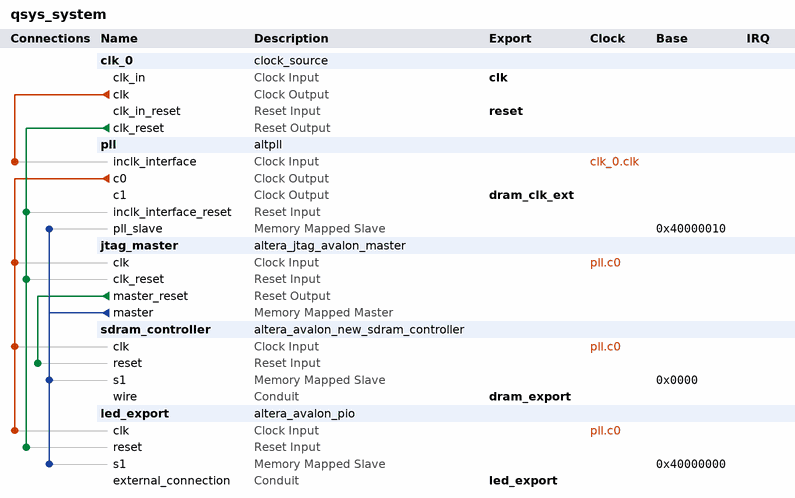
[diagram p0: system contents]
# Platform Designer (Qsys) system qsys_system, MAX 10 10M50DAF484C7G
# Parameters at their usual value, and those the tool derives, are not listed.
package require -exact qsys 18.1
create_system qsys_system
set_project_property DEVICE_FAMILY {MAX 10}
set_project_property DEVICE 10M50DAF484C7G

add_instance clk_0 clock_source 18.1
set_instance_parameter_value clk_0 clockFrequency 50000000

add_instance pll altpll 18.1
set_instance_parameter_value pll CLK0_DIVIDE_BY 1
set_instance_parameter_value pll CLK0_MULTIPLY_BY 2
set_instance_parameter_value pll CLK1_DIVIDE_BY 1
set_instance_parameter_value pll CLK1_DUTY_CYCLE 50
set_instance_parameter_value pll CLK1_MULTIPLY_BY 2
set_instance_parameter_value pll CLK1_PHASE_SHIFT -3000
set_instance_parameter_value pll INCLK0_INPUT_FREQUENCY 20000
set_instance_parameter_value pll PORT_ARESET PORT_UNUSED
set_instance_parameter_value pll PORT_LOCKED PORT_UNUSED
set_instance_parameter_value pll PORT_clk1 PORT_USED
set_instance_parameter_value pll PORT_clk2 PORT_UNUSED
set_instance_parameter_value pll PORT_clk3 PORT_UNUSED

add_instance jtag_master altera_jtag_avalon_master 18.1

add_instance sdram_controller altera_avalon_new_sdram_controller 18.1
set_instance_parameter_value sdram_controller TAC 6.0
set_instance_parameter_value sdram_controller TRCD 15.0
set_instance_parameter_value sdram_controller TRFC 55.0
set_instance_parameter_value sdram_controller TRP 15.0
set_instance_parameter_value sdram_controller TWR 15.0
set_instance_parameter_value sdram_controller casLatency 2
set_instance_parameter_value sdram_controller columnWidth 10
set_instance_parameter_value sdram_controller dataWidth 16
set_instance_parameter_value sdram_controller generateSimulationModel false
set_instance_parameter_value sdram_controller initRefreshCommands 8
set_instance_parameter_value sdram_controller model single_Micron_MT48LC4M32B2_7_chip
set_instance_parameter_value sdram_controller numberOfBanks 4
set_instance_parameter_value sdram_controller numberOfChipSelects 1
set_instance_parameter_value sdram_controller powerUpDelay 100.0
set_instance_parameter_value sdram_controller refreshPeriod 7.8125
set_instance_parameter_value sdram_controller rowWidth 13

add_instance led_export altera_avalon_pio 18.1
set_instance_parameter_value led_export direction Output
set_instance_parameter_value led_export width 8

# connections
add_connection clk_0.clk pll.inclk_interface clock
add_connection pll.c0 jtag_master.clk clock
add_connection pll.c0 led_export.clk clock
add_connection pll.c0 sdram_controller.clk clock
add_connection clk_0.clk_reset jtag_master.clk_reset reset
add_connection clk_0.clk_reset led_export.reset reset
add_connection clk_0.clk_reset pll.inclk_interface_reset reset
add_connection jtag_master.master_reset sdram_controller.reset reset
add_connection jtag_master.master led_export.s1 avalon
set_connection_parameter_value jtag_master.master/led_export.s1 baseAddress 0x40000000
add_connection jtag_master.master pll.pll_slave avalon
set_connection_parameter_value jtag_master.master/pll.pll_slave baseAddress 0x40000010
add_connection jtag_master.master sdram_controller.s1 avalon
set_connection_parameter_value jtag_master.master/sdram_controller.s1 baseAddress 0x0000

# exported interfaces
add_interface clk clock sink
set_interface_property clk EXPORT_OF clk_0.clk_in
add_interface dram_clk_ext clock source
set_interface_property dram_clk_ext EXPORT_OF pll.c1
add_interface dram_export conduit end
set_interface_property dram_export EXPORT_OF sdram_controller.wire
add_interface led_export conduit end
set_interface_property led_export EXPORT_OF led_export.external_connection
add_interface reset reset sink
set_interface_property reset EXPORT_OF clk_0.clk_in_reset

set_interconnect_requirement {$system} qsys_mm.clockCrossingAdapter HANDSHAKE
set_interconnect_requirement {$system} qsys_mm.enableEccProtection FALSE
set_interconnect_requirement {$system} qsys_mm.insertDefaultSlave FALSE
set_interconnect_requirement {$system} qsys_mm.maxAdditionalLatency 1

save_system qsys_system.qsys
